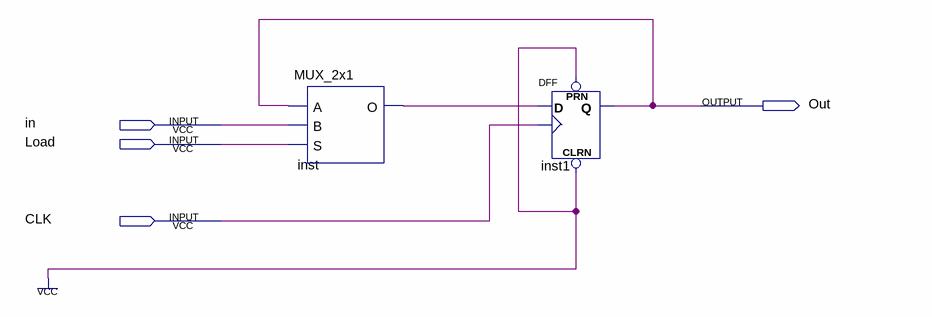
[diagram p0: schematic sheet]
// Quartus schematic Cell.bdf as structural Verilog: 2 symbols, 4 pins
module Cell (
  input  in,
  input  Load,
  input  CLK,
  output Out
);

  wire inst_o;

  MUX_2x1 inst (.A(Out), .B(in), .S(Load), .O(inst_o));
  DFF inst1 (.CLRN(1'b1), .CLK(CLK), .D(inst_o), .PRN(1'b1), .Q(Out));
endmodule
